# EAGLE schematic MJ828 - rev.3 - TCAN334 - prod (EAGLE 9.6.2)
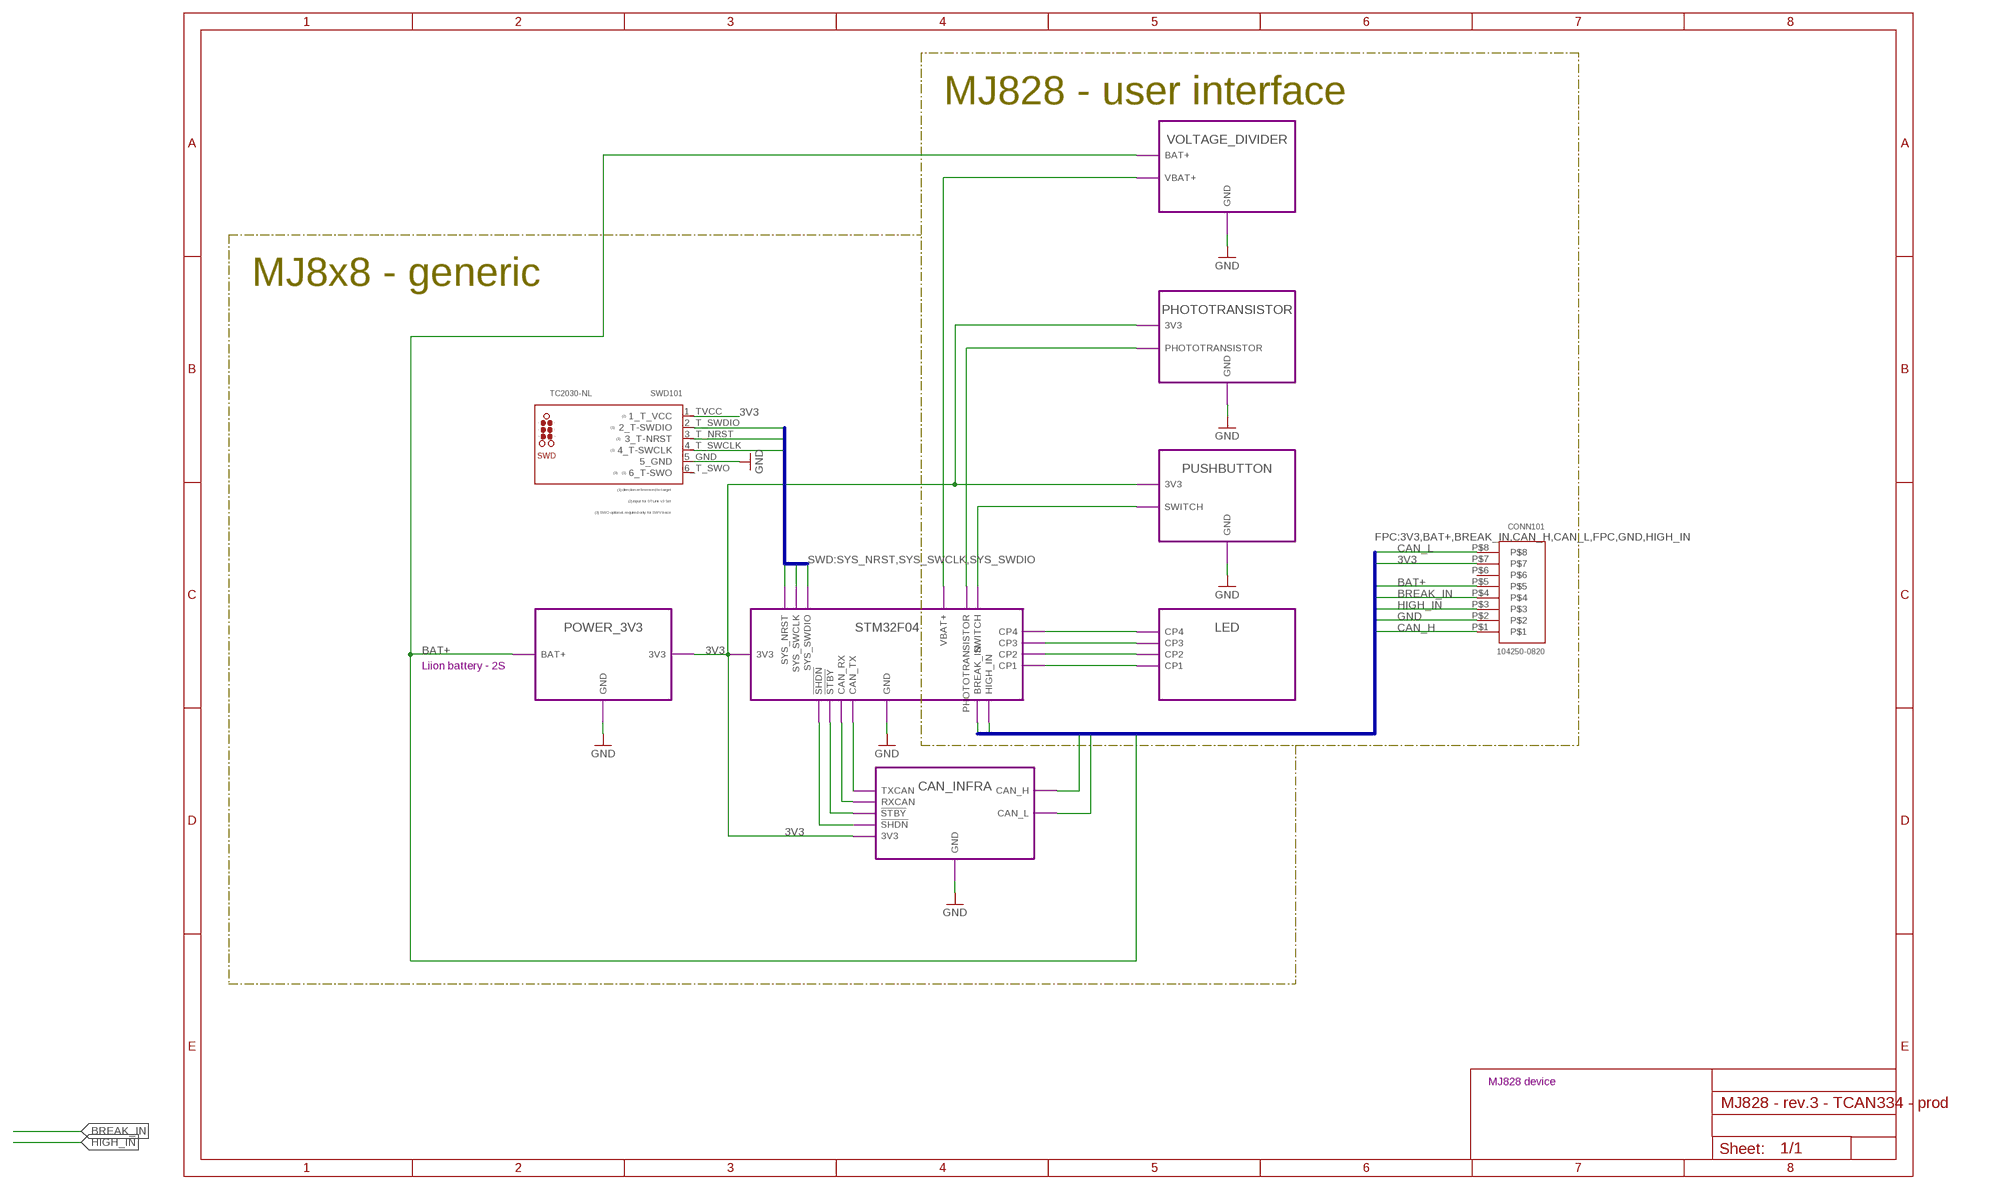
[diagram p0: schematic, sheet 1]

## Parts
CONN101  104250-0820  [SMD]
SWD101  TC2030-NL  TC2030  [TC2030-NL]

## Module instances
POWER_3V3 = POWER_3V3 (part numbers offset by 200)
STM32F04 = STM32 (part numbers offset by 400)
CAN_INFRA = CAN_INFRA (part numbers offset by 500)
PUSHBUTTON = PUSHBUTTON (part numbers offset by 700)
PHOTOTRANSISTOR = PHOTOTRANSISTOR (part numbers offset by 600)
LED = LED (part numbers offset by 800)
VOLTAGE_DIVIDER = VOLTAGE_DIVIDER (part numbers offset by 900)

## Nets
3V3 [3V3]: CONN101.P$7 SWD101.1_TVCC(1_T_VCC) ; port POWER_3V3.3V3 STM32F04.3V3 PUSHBUTTON.3V3 PHOTOTRANSISTOR.3V3 CAN_INFRA.3V3
!SHDN!: port STM32F04.!SHDN! CAN_INFRA.!SHDN!
!STBY! [signal]: port CAN_INFRA.!STBY! STM32F04.!STBY!
BAT+ [BAT+]: CONN101.P$5 ; port POWER_3V3.BAT+ VOLTAGE_DIVIDER.BAT+
BREAK_IN [signal]: CONN101.P$4 ; port STM32F04.BREAK_IN
CAN_H [signal]: CONN101.P$1 ; port CAN_INFRA.CAN_H
CAN_L [signal]: CONN101.P$8 ; port CAN_INFRA.CAN_L
CAN_RX [signal]: port CAN_INFRA.RXCAN STM32F04.CAN_RX
CAN_TX [signal]: port CAN_INFRA.TXCAN STM32F04.CAN_TX
CP1 [signal]: port STM32F04.CP1 LED.CP1
CP2 [signal]: port STM32F04.CP2 LED.CP2
CP3 [signal]: port STM32F04.CP3 LED.CP3
CP4 [signal]: port STM32F04.CP4 LED.CP4
GND: CONN101.P$2 SWD101.5_GND ; port STM32F04.GND POWER_3V3.GND CAN_INFRA.GND PUSHBUTTON.GND PHOTOTRANSISTOR.GND VOLTAGE_DIVIDER.GND
HIGH_IN [signal]: CONN101.P$3 ; port STM32F04.HIGH_IN
PHOTOTRANSISTOR: port PHOTOTRANSISTOR.PHOTOTRANSISTOR STM32F04.PHOTOTRANSISTOR
SWITCH: port STM32F04.SWITCH PUSHBUTTON.SWITCH
SYS_NRST [signal]: SWD101.3_T_NRST(3_T-NRST) ; port STM32F04.SYS_NRST
SYS_SWCLK [signal]: SWD101.4_T_SWCLK(4_T-SWCLK) ; port STM32F04.SYS_SWCLK
SYS_SWDIO [signal]: SWD101.2_T_SWDIO(2_T-SWDIO) ; port STM32F04.SYS_SWDIO
VBAT+: port STM32F04.VBAT+ VOLTAGE_DIVIDER.VBAT+
Unconnected: CONN101.P$6 SWD101.6_T_SWO(6_T-SWO)

## Buses
SWD:SYS_NRST,SYS_SWCLK,SYS_SWDIO
FPC:3V3,BAT+,BREAK_IN,CAN_H,CAN_L,FPC,GND,HIGH_IN

## Notes on the sheet
- MJ828 - user interface
- MJ8x8 - generic
- Liion battery - 2S
- MJ828 device

## Library data of the parts
CONN101 = 1042500820 - Board to Board Connector, 8p - Header:104250-0820
SWD101 = tag-connect:TC2030: TC2030 pad no. Function STLink v3 CN1 pin no. Function 1 Reserved (1) 2 Reserved (1) 1 T_Vcc 3 T_Vcc (2) 2 T_SWDIO 4 T_JTMS/T_SWDIO 5 GND 4 T_SWCLK 6 T_JCLK / T_SWCLK 5 GND 7 GND 6 8 T_JTDO / T_SWO (3) 9 T_JRCLK (4) / NC (5) 10 T_JTDI / NC (5) 11 GNDDetect (6) 3 T_NRST 12 T_NRST 13 T_VCP_RX (7) 14 T_VCP_TX (2) (1) Do not connect to the target (2) Input for STLINK-V3SET (3) SWO is optional, required only for Serial Wire Viewer (SWV) trace (4) Optional loopback of T_JCLK on the target side, required if loopback is removed on the STLINK-V3SET side (5) NC means not required for the SWD connection (6) Tied to GND by STLINK-V3SET firmware; may be used by the target for detection of the tool (7) Output for STLINK-V3SET

## Module POWER_3V3
Ports: GND(pwr) BAT+(pwr) 3V3(pwr)
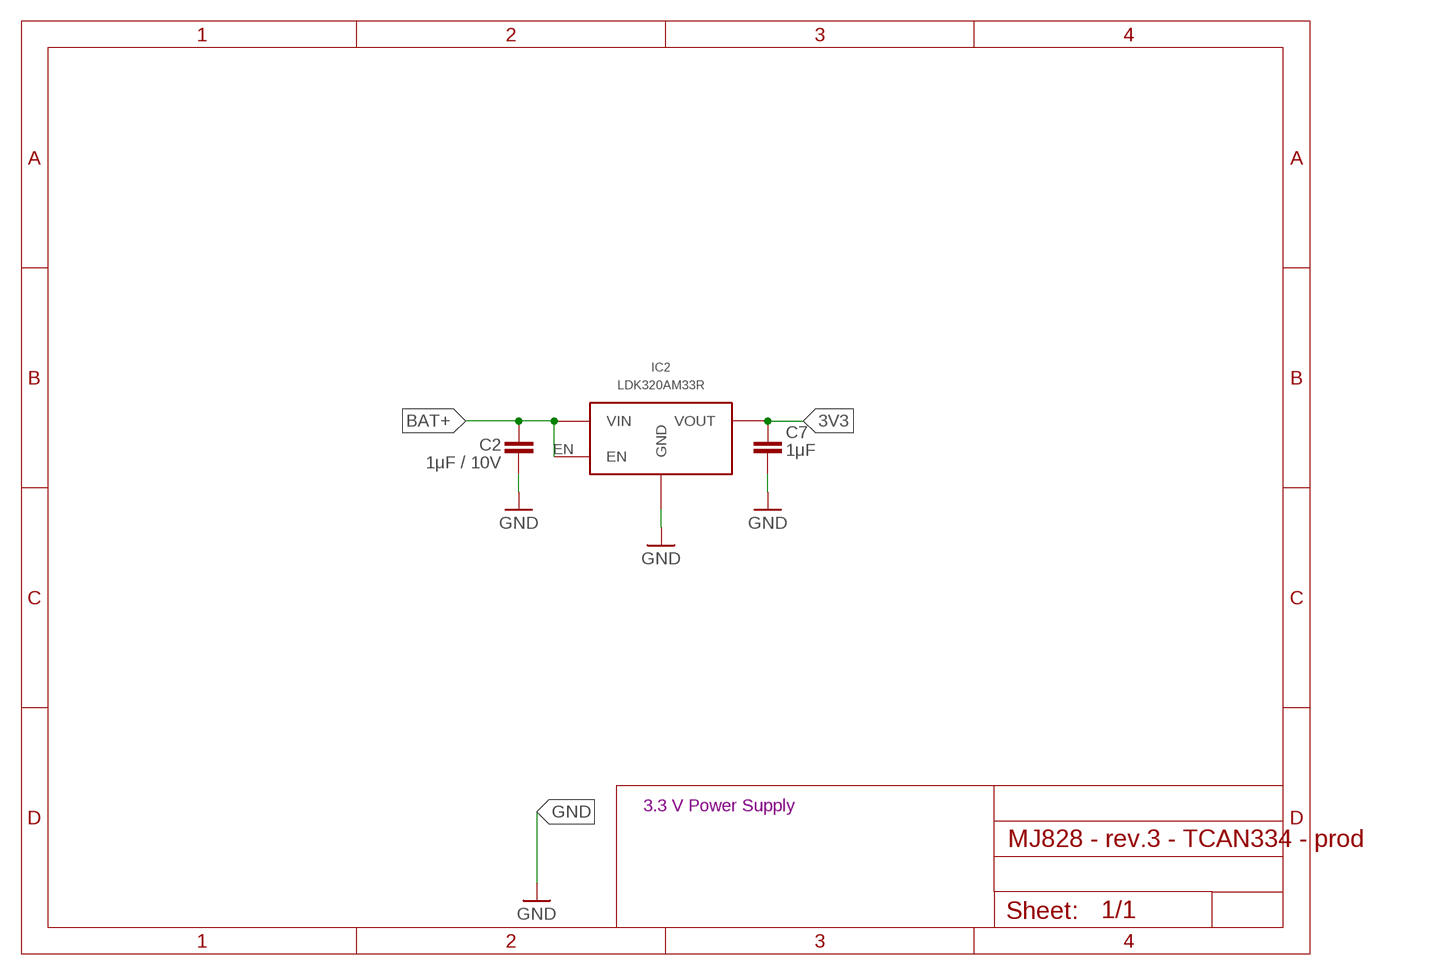
[diagram p1: schematic, module POWER_3V3, sheet 1]

### Parts
C2  1μF / 10V  C-EUC0402  [C0402]
C7  1μF  C-EUC0402  [C0402]
IC2  LDK320AM33R  LDK320SOT-23-5L  [SOT-23-5L]

### Nets
3V3 [3V3]: C7.2 IC2.OUT(VOUT)
BAT+ [BAT+]: C2.1 IC2.EN IC2.IN(VIN)
GND: C2.2 C7.1 IC2.GND

### Notes on the sheet
- 3.3 V Power Supply

### Library data of the parts
C2 C7 = rcl:C-EU: CAPACITOR, European symbol; SPICEPREFIX: C
IC2 = LDK320 5V LDO:LDK320

## Module STM32
Ports: GND(pwr) 3V3(pwr) SYS_NRST(in) SYS_SWCLK(io) SYS_SWDIO(io) CAN_RX(in) CAN_TX(out) !STBY!(out) SWITCH(in) PHOTOTRANSISTOR(in) CP4(pwr) CP3(pwr) CP2(pwr) CP1(pwr) BREAK_IN(in) HIGH_IN(in) VBAT+(in) !SHDN!(out)
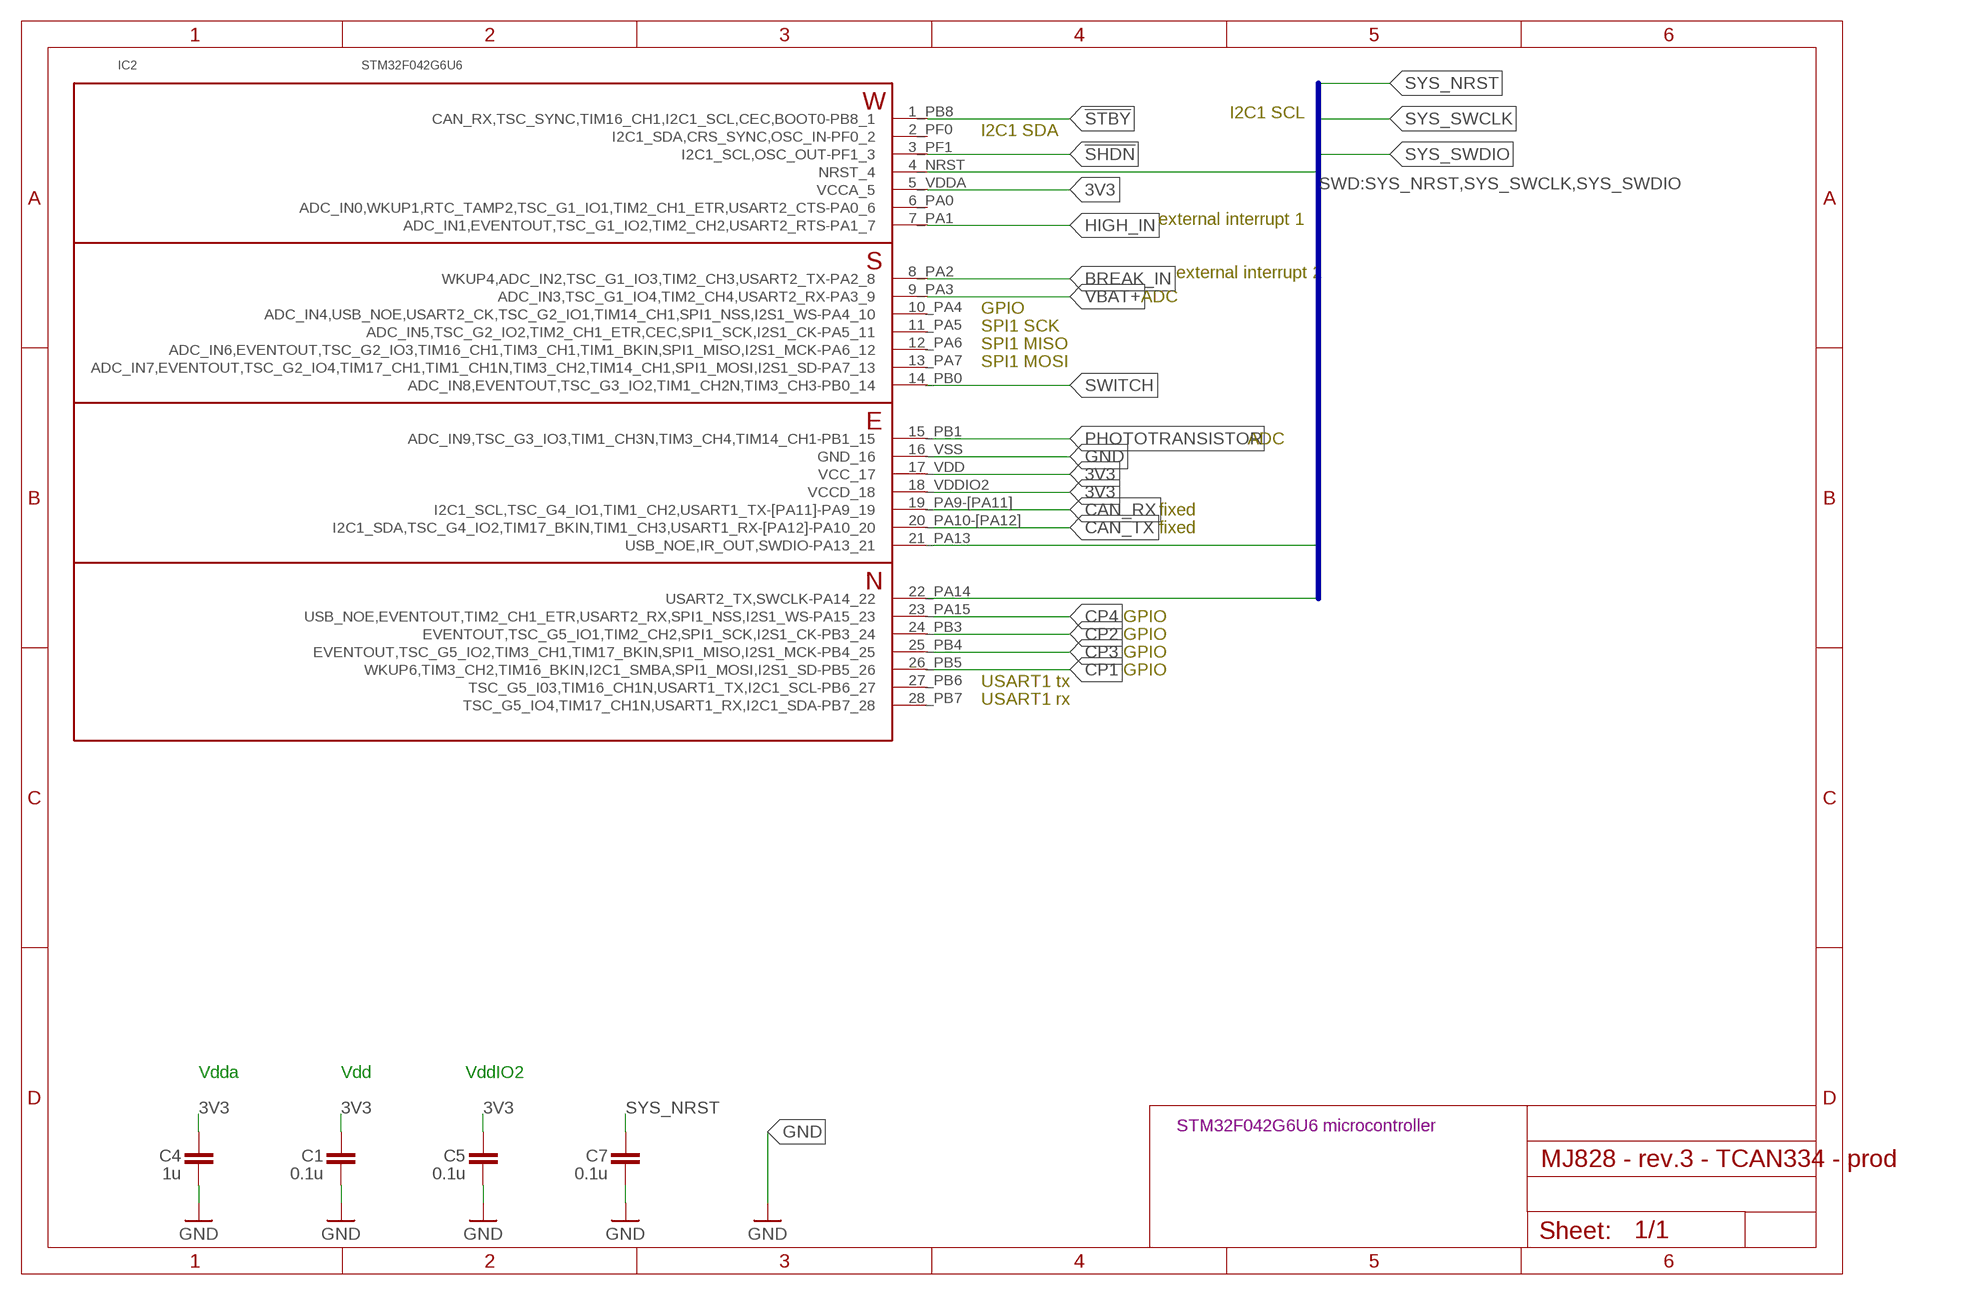
[diagram p2: schematic, module STM32, sheet 1]

### Parts
C1  0.1u  C-EUC0402  [C0402]
C4  1u  C-EUC0402  [C0402]
C5  0.1u  C-EUC0402  [C0402]
C7  0.1u  C-EUC0402  [C0402]
IC2  STM32F042G6U6  STM32F042G6  [UFQFPN-28]

### Nets
3V3 [3V3]: C1.2 C4.2 C5.2 IC2.5_VDDA(VCCA_5) IC2.17_VDD(VCC_17) IC2.18_VDDIO2(VCCD_18)
!SHDN!: IC2.3_PF1(I2C1_SCL,OSC_OUT-PF1_3)
!STBY!: IC2.1_PB8(CAN_RX,TSC_SYNC,TIM16_CH1,I2C1_SCL,CEC,BOOT0-PB8_1)
BREAK_IN [signal]: IC2.8_PA2(WKUP4,ADC_IN2,TSC_G1_IO3,TIM2_CH3,USART2_TX-PA2_8)
CAN_RX: IC2.19_PA9-[PA11](I2C1_SCL,TSC_G4_IO1,TIM1_CH2,USART1_TX-[PA11]-PA9_19)
CAN_TX: IC2.20_PA10-[PA12](I2C1_SDA,TSC_G4_IO2,TIM17_BKIN,TIM1_CH3,USART1_RX-[PA12]-PA10_20)
CP1 [signal]: IC2.26_PB5(WKUP6,TIM3_CH2,TIM16_BKIN,I2C1_SMBA,SPI1_MOSI,I2S1_SD-PB5_26)
CP2 [signal]: IC2.24_PB3(EVENTOUT,TSC_G5_IO1,TIM2_CH2,SPI1_SCK,I2S1_CK-PB3_24)
CP3 [signal]: IC2.25_PB4(EVENTOUT,TSC_G5_IO2,TIM3_CH1,TIM17_BKIN,SPI1_MISO,I2S1_MCK-PB4_25)
CP4 [signal]: IC2.23_PA15(USB_NOE,EVENTOUT,TIM2_CH1_ETR,USART2_RX,SPI1_NSS,I2S1_WS-PA15_23)
GND: C1.1 C4.1 C5.1 C7.1 IC2.16_VSS(GND_16)
HIGH_IN [signal]: IC2.7_PA1(ADC_IN1,EVENTOUT,TSC_G1_IO2,TIM2_CH2,USART2_RTS-PA1_7)
PHOTOTRANSISTOR: IC2.15_PB1(ADC_IN9,TSC_G3_IO3,TIM1_CH3N,TIM3_CH4,TIM14_CH1-PB1_15)
SWITCH: IC2.14_PB0(ADC_IN8,EVENTOUT,TSC_G3_IO2,TIM1_CH2N,TIM3_CH3-PB0_14)
SYS_NRST: C7.2 IC2.4_NRST(NRST_4)
SYS_SWCLK: IC2.22_PA14(USART2_TX,SWCLK-PA14_22)
SYS_SWDIO: IC2.21_PA13(USB_NOE,IR_OUT,SWDIO-PA13_21)
VBAT+: IC2.9_PA3(ADC_IN3,TSC_G1_IO4,TIM2_CH4,USART2_RX-PA3_9)
Unconnected: IC2.2_PF0(I2C1_SDA,CRS_SYNC,OSC_IN-PF0_2) IC2.6_PA0(ADC_IN0,WKUP1,RTC_TAMP2,TSC_G1_IO1,TIM2_CH1_ETR,USART2_CTS-PA0_6) IC2.10_PA4(ADC_IN4,USB_NOE,USART2_CK,TSC_G2_IO1,TIM14_CH1,SPI1_NSS,I2S1_WS-PA4_10) IC2.11_PA5(ADC_IN5,TSC_G2_IO2,TIM2_CH1_ETR,CEC,SPI1_SCK,I2S1_CK-PA5_11) IC2.12_PA6(ADC_IN6,EVENTOUT,TSC_G2_IO3,TIM16_CH1,TIM3_CH1,TIM1_BKIN,SPI1_MISO,I2S1_MCK-PA6_12) IC2.13_PA7(ADC_IN7,EVENTOUT,TSC_G2_IO4,TIM17_CH1,TIM1_CH1N,TIM3_CH2,TIM14_CH1,SPI1_MOSI,I2S1_SD-PA7_13) IC2.27_PB6(TSC_G5_I03,TIM16_CH1N,USART1_TX,I2C1_SCL-PB6_27) IC2.28_PB7(TSC_G5_IO4,TIM17_CH1N,USART1_RX,I2C1_SDA-PB7_28)

### Buses
SWD:SYS_NRST,SYS_SWCLK,SYS_SWDIO

### Notes on the sheet
- I2C1 SCL
- I2C1 SDA
- external interrupt 1
- external interrupt 2
- ADC
- GPIO
- SPI1 SCK
- SPI1 MISO
- SPI1 MOSI
- ADC
- fixed
- fixed
- GPIO
- GPIO
- GPIO
- GPIO
- USART1 tx
- USART1 rx
- Vdda | Vdd | VddIO2
- STM32F042G6U6 microcontroller

### Library data of the parts
C1 C4 C5 C7 = rcl:C-EU: CAPACITOR, European symbol; SPICEPREFIX: C
IC2 = STM32F042G6:STM32F042G6

## Module CAN_INFRA
Ports: GND(pwr) 3V3(pwr) CAN_H(io) CAN_L(io) TXCAN(in) RXCAN(out) !STBY!(in) !SHDN!(in)
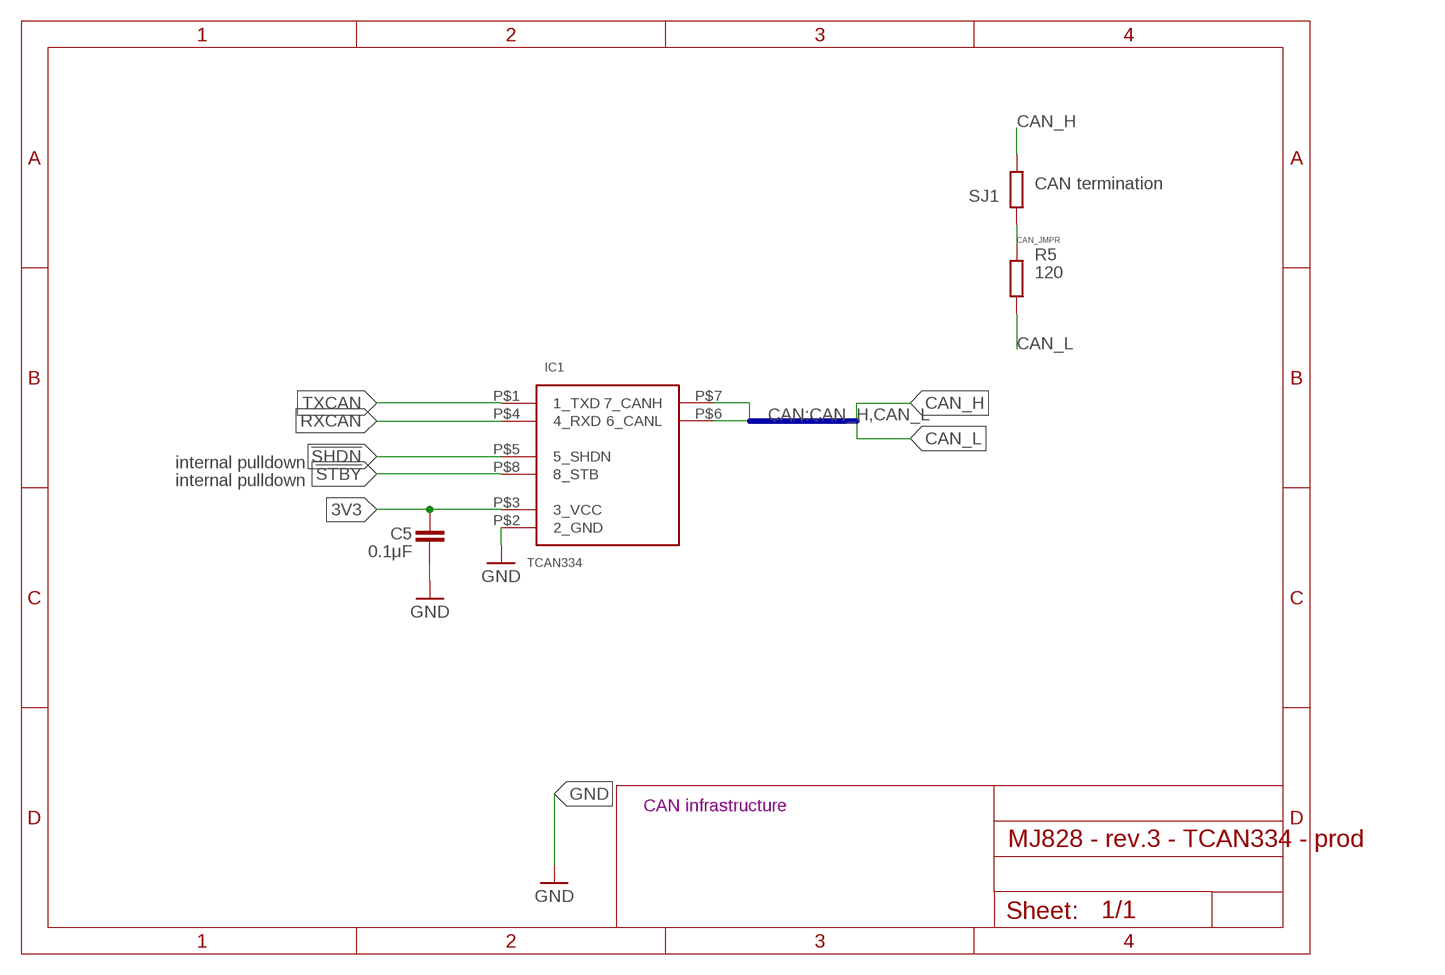
[diagram p3: schematic, module CAN_INFRA, sheet 1]

### Parts
C5  0.1μF  C-EUC0402  [C0402]
IC1  TCAN334  CAN33X  [SOT23-8]
R5  120  R-EU_R0805  [R0805]
SJ1  CAN termination  R-EU_R0402  [R0402]

### Nets
3V3 [3V3]: C5.1 IC1.P$3(3_VCC)
!SHDN!: IC1.P$5(5_SHDN)
!STBY! [signal]: IC1.P$8(8_STB)
CAN_H: IC1.P$7(7_CANH) SJ1.2
CAN_JMPR [signal]: R5.2 SJ1.1
CAN_L: IC1.P$6(6_CANL) R5.1
GND: C5.2 IC1.P$2(2_GND)
RXCAN [signal]: IC1.P$4(4_RXD)
TXCAN [signal]: IC1.P$1(1_TXD)

### Buses
CAN:CAN_H,CAN_L

### Notes on the sheet
- internal pulldown
- internal pulldown
- CAN infrastructure

### Library data of the parts
C5 = rcl:C-EU: CAPACITOR, European symbol; SPICEPREFIX: C
IC1 = TCAN33x - 3.3V CAN Transciever:CAN33X
R5 SJ1 = rcl:R-EU_: RESISTOR, European symbol; SPICEPREFIX: R

## Module PUSHBUTTON
Ports: GND(pwr) 3V3(pwr) SWITCH(out)
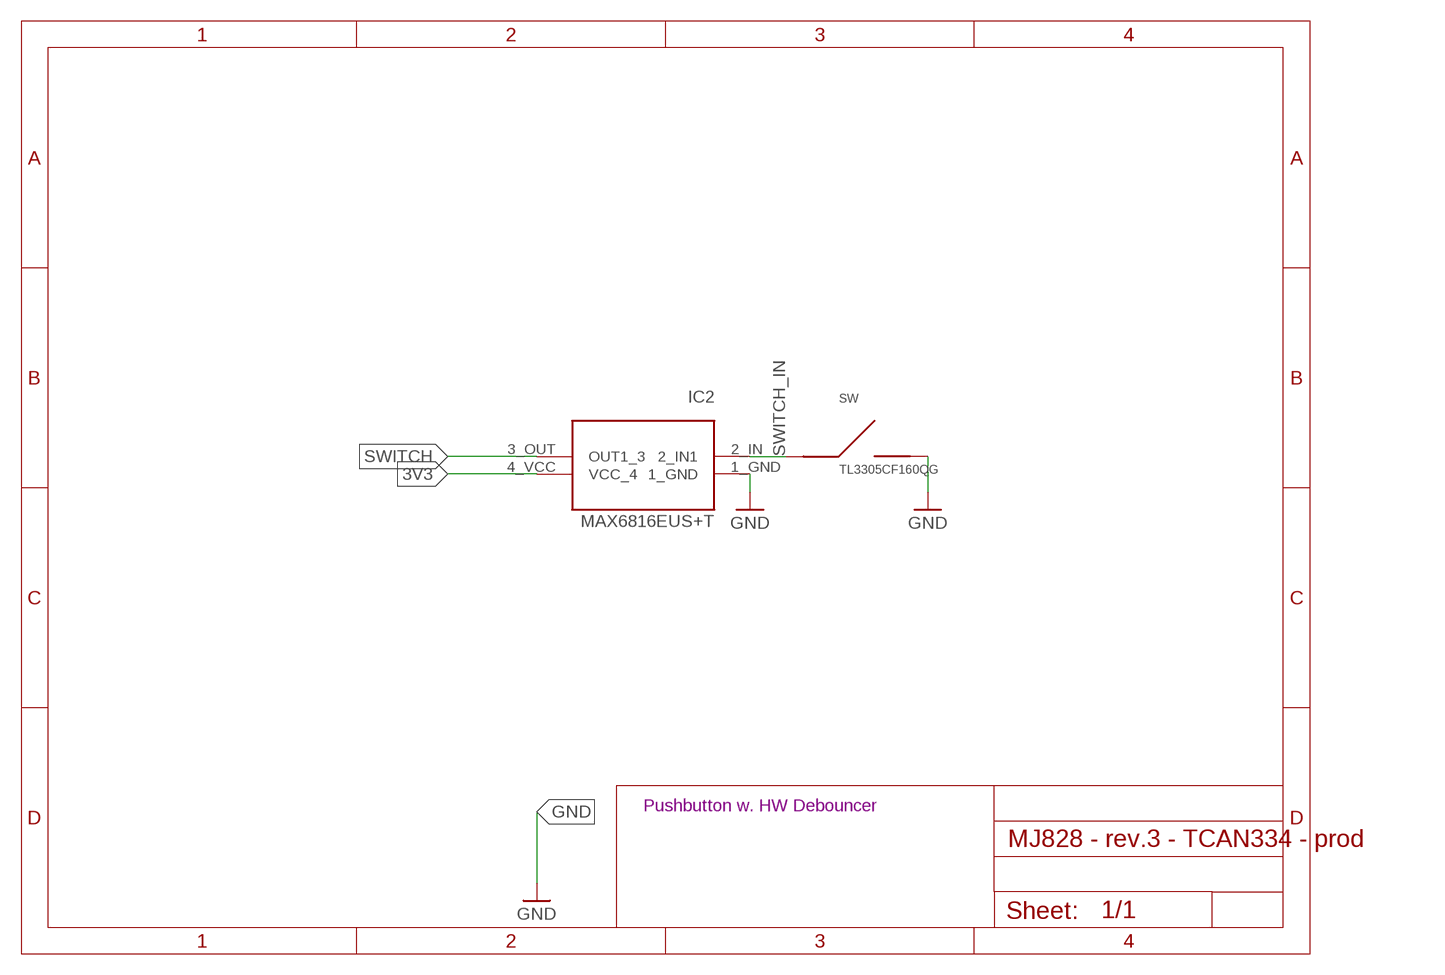
[diagram p4: schematic, module PUSHBUTTON, sheet 1]

### Parts
IC2  MAX6816EUS+T  MAX6816  [4SOT143]
SW  TL3305CF160QG  TL3305-844809  [SMD]

### Nets
3V3: IC2.4_VCC(VCC_4)
GND: IC2.1_GND SW.3 SW.4
SWITCH: IC2.3_OUT(OUT1_3)
SWITCH_IN: IC2.2_IN(2_IN1) SW.1 SW.2

### Notes on the sheet
- Pushbutton w. HW Debouncer

### Library data of the parts
IC2 = MAX6818 CMOS Switch debouncer:MAX6816
SW = TL3305-844809 SPST-NO Tact Switch:TL3305-844809

## Module PHOTOTRANSISTOR
Ports: GND(pwr) 3V3(pwr) PHOTOTRANSISTOR(out)
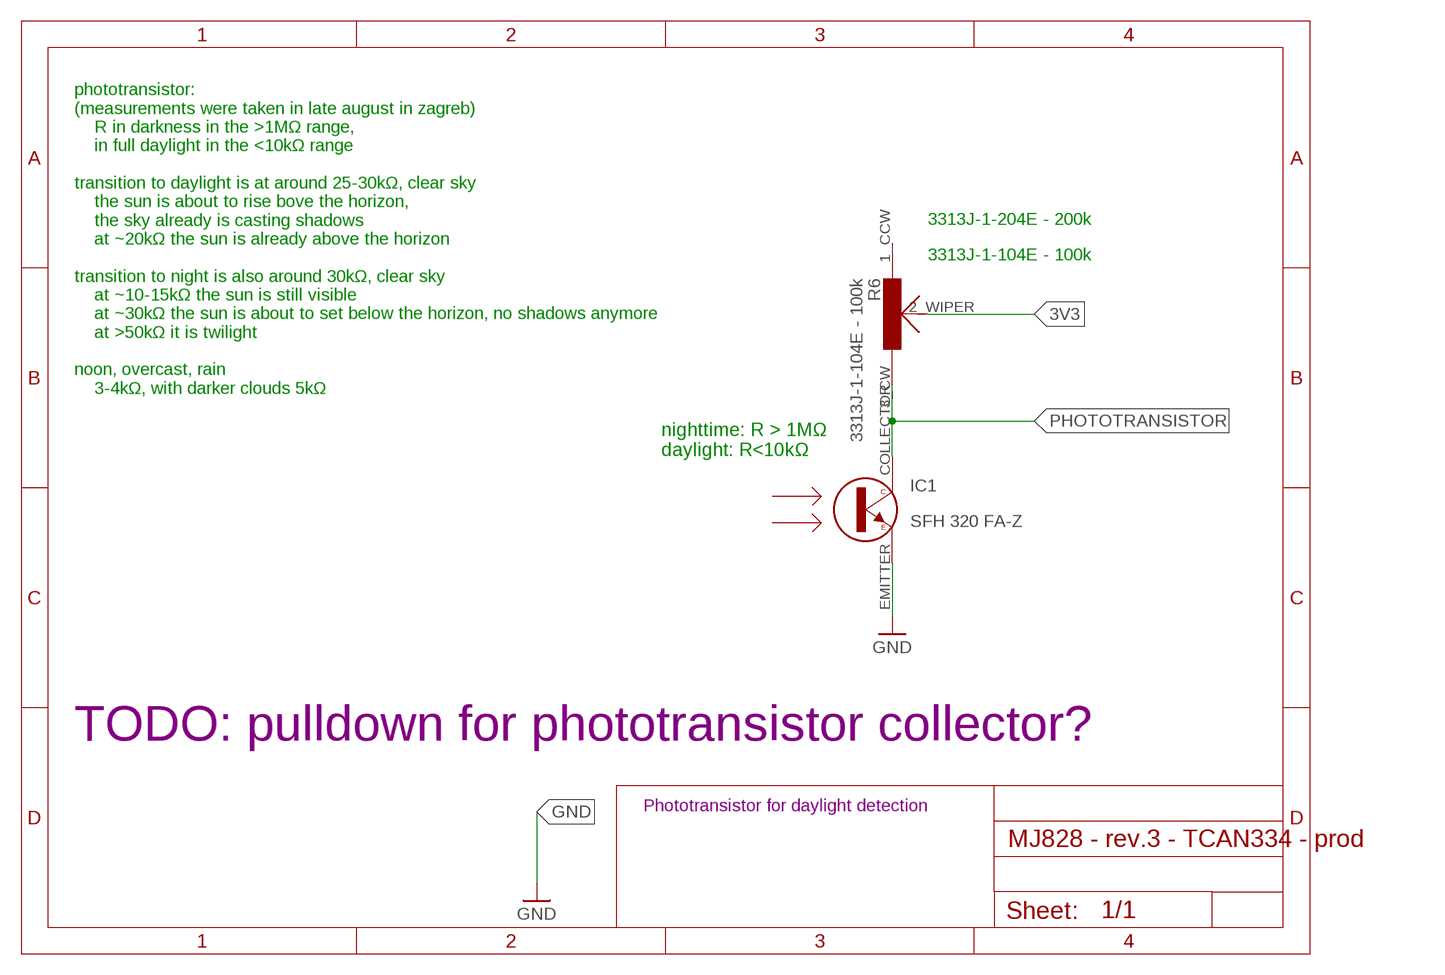
[diagram p5: schematic, module PHOTOTRANSISTOR, sheet 1]

### Parts
IC1  SFH 320 FA-Z  SFH320FA  [P-LCC-2]
R6  3313J-1-104E - 100k  3313  [3313]

### Nets
3V3: R6.2_WIPER
GND: IC1.EMITTER
PHOTOTRANSISTOR: IC1.COLLECTOR R6.3_CW
Unconnected: R6.1_CCW

### Notes on the sheet
- phototransistor: 
  (measurements were taken in late august in zagreb)
      R in darkness in the >1MΩ range, 
      in full daylight in the <10kΩ range 
  
  transition to daylight is at around 25-30kΩ, clear sky
      the sun is about to rise bove the horizon,
      the sky already is casting shadows
      at ~20kΩ the sun is already above the horizon
  
  transition to night is also around 30kΩ, clear sky
      at ~10-15kΩ the sun is still visible
      at ~30kΩ the sun is about to set below the horizon, no shadows anymore
      at >50kΩ it is twilight
  
  noon, overcast, rain
      3-4kΩ, with darker clouds 5kΩ
- 3313J-1-204E - 200k
- 3313J-1-104E - 100k
- nighttime: R > 1MΩ
  daylight: R<10kΩ
- TODO: pulldown for phototransistor collector?
- Phototransistor for daylight detection

### Library data of the parts
IC1 = SFH 320 FA - IR Phototransistor:SFH320FA
R6 = 3313 - Trim Poti:3313

## Module LED
Ports: CP1(pwr) CP2(pwr) CP3(pwr) CP4(pwr)
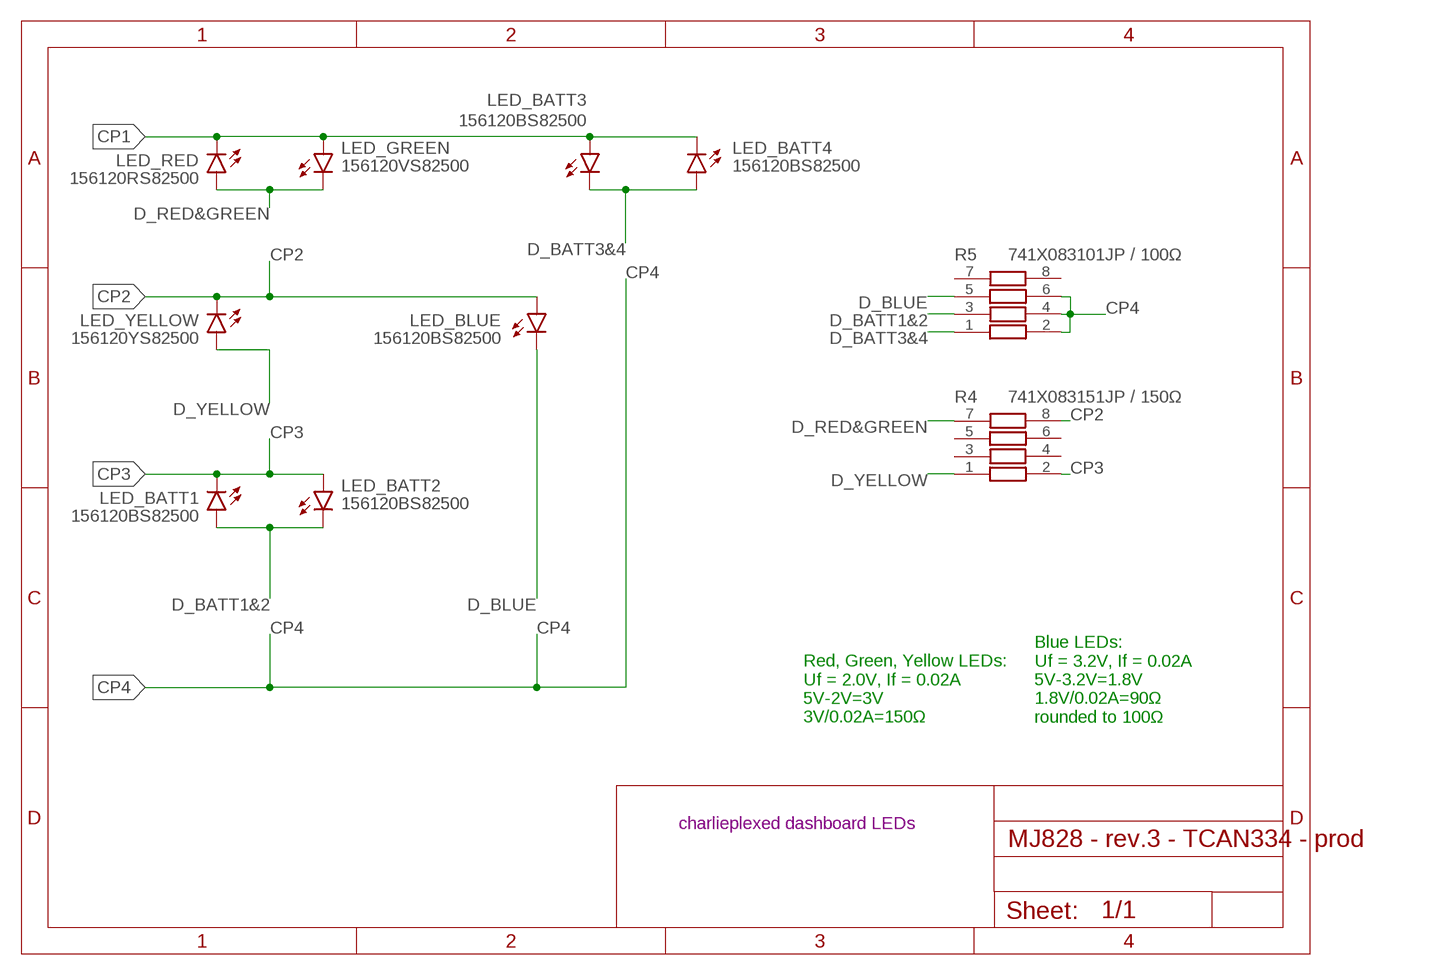
[diagram p6: schematic, module LED, sheet 1]

### Parts
LED_BATT1  156120BS82500  LEDSML1206  [SML1206]
LED_BATT2  156120BS82500  LEDSML1206  [SML1206]
LED_BATT3  156120BS82500  LEDSML1206  [SML1206]
LED_BATT4  156120BS82500  LEDSML1206  [SML1206]
LED_BLUE  156120BS82500  LEDSML1206  [SML1206]
LED_GREEN  156120VS82500  LEDSML1206  [SML1206]
LED_RED  156120RS82500  LEDSML1206  [SML1206]
LED_YELLOW  156120YS82500  LEDSML1206  [SML1206]
R4  741X083151JP / 150Ω  741X083331JP  [0402]
R5  741X083101JP / 100Ω  741X083331JP  [0402]

### Nets
CP1 [signal]: LED_BATT3.A LED_BATT4.C LED_GREEN.A LED_RED.C
CP2 [signal]: LED_BLUE.A LED_YELLOW.C R4.8
CP3 [signal]: LED_BATT1.C LED_BATT2.A R4.2
CP4 [signal]: R5.2 R5.4 R5.6
D_BATT1&2 [signal]: LED_BATT1.A LED_BATT2.C R5.3
D_BATT3&4 [signal]: LED_BATT3.C LED_BATT4.A R5.1
D_BLUE [signal]: LED_BLUE.C R5.5
D_RED&GREEN [signal]: LED_GREEN.C LED_RED.A R4.7
D_YELLOW [signal]: LED_YELLOW.A R4.1
Unconnected: R4.3 R4.4 R4.5 R4.6 R5.7 R5.8

### Notes on the sheet
- Red, Green, Yellow LEDs:
  Uf = 2.0V, If = 0.02A
  5V-2V=3V
  3V/0.02A=150Ω
- Blue LEDs:
  Uf = 3.2V, If = 0.02A
  5V-3.2V=1.8V
  1.8V/0.02A=90Ω
  rounded to 100Ω
- charlieplexed dashboard LEDs

### Library data of the parts
LED_BATT1-LED_BATT4 LED_BLUE LED_GREEN LED_RED LED_YELLOW = led:LED: LED OSRAM: - CHIPLED LG R971, LG N971, LY N971, LG Q971, LY Q971, LO R971, LY R971 LH N974, LH R974 LS Q976, LO Q976, LY Q976 LO Q996 - Hyper CHIPLED LW Q18S LB Q993, LB Q99A, LB R99A - SideLED LS A670, LO A670, LY A670, LG A670, LP A670 LB A673, LV A673, LT A673, LW A673 LH A674 LY A675 LS A676, LA A676, LO A676, LY A676, LW A676 LS A679, LY A679, LG A679 - Hyper Micro SIDELED® LS Y876, LA Y876, LO Y876, LY Y876 LT Y87S - SmartLED LW L88C, LW L88S LB L89C, LB L89S, LG L890 LS L89K, LO L89K, LY L89K LS L896, LA L896, LO L896, LY L896 - TOPLED LS T670, LO T670, LY T670, LG T670, LP T670 LSG T670, LSP T670, LSY T670, LOP T670, LYG T670 LG T671, LOG T671, LSG T671 LB T673, LV T673, LT T673, LW T673 LH T674 LS T676, LA T676, LO T676, LY T676, LB T676, LH T676, LSB T676, LW T676 LB T67C, LV T67C, LT T67C, LS T67K, LO T67K, LY T67K, LW E67C LS E67B, LA E67B, LO E67B, LY E67B, LB E67C, LV E67C, LT E67C LW T67C LS T679, LY T679, LG T679 LS T770, LO T770, LY T770, LG T770, LP T770 LB T773, LV T773, LT T773, LW T773 LH T774 LS E675, LA E675, LY E675, LS T675 LS T776, LA T776, LO T776, LY T776, LB T776 LHGB T686 LT T68C, LB T68C - Hyper Mini TOPLED® LB M676 - Mini TOPLED Santana® LG M470 LS M47K, LO M47K, LY M47K Source: http://www.osram.convergy.de LUXEON: - LUMILED® LXK2-PW12-R00, LXK2-PW12-S00, LXK2-PW14-U00, LXK2-PW14-V00 LXK2-PM12-R00, LXK2-PM12-S00, LXK2-PM14-U00 LXK2-PE12-Q00, LXK2-PE12-R00, LXK2-PE12-S00, LXK2-PE14-T00, LXK2-PE14-U00 LXK2-PB12-K00, LXK2-PB12-L00, LXK2-PB12-M00, LXK2-PB14-N00, LXK2-PB14-P00, LXK2-PB14-Q00 LXK2-PR12-L00, LXK2-PR12-M00, LXK2-PR14-Q00, LXK2-PR14-R00 LXK2-PD12-Q00, LXK2-PD12-R00, LXK2-PD12-S00 LXK2-PH12-R00, LXK2-PH12-S00 LXK2-PL12-P00, LXK2-PL12-Q00, LXK2-PL12-R00 Source: www.luxeon.com KINGBRIGHT: KA-3528ASYC Source: www.kingbright.com
R4 R5 = 741X083331JP Resistor Array:741X083331JP

## Module VOLTAGE_DIVIDER
Ports: GND(pwr) BAT+(pwr) VBAT+(out)
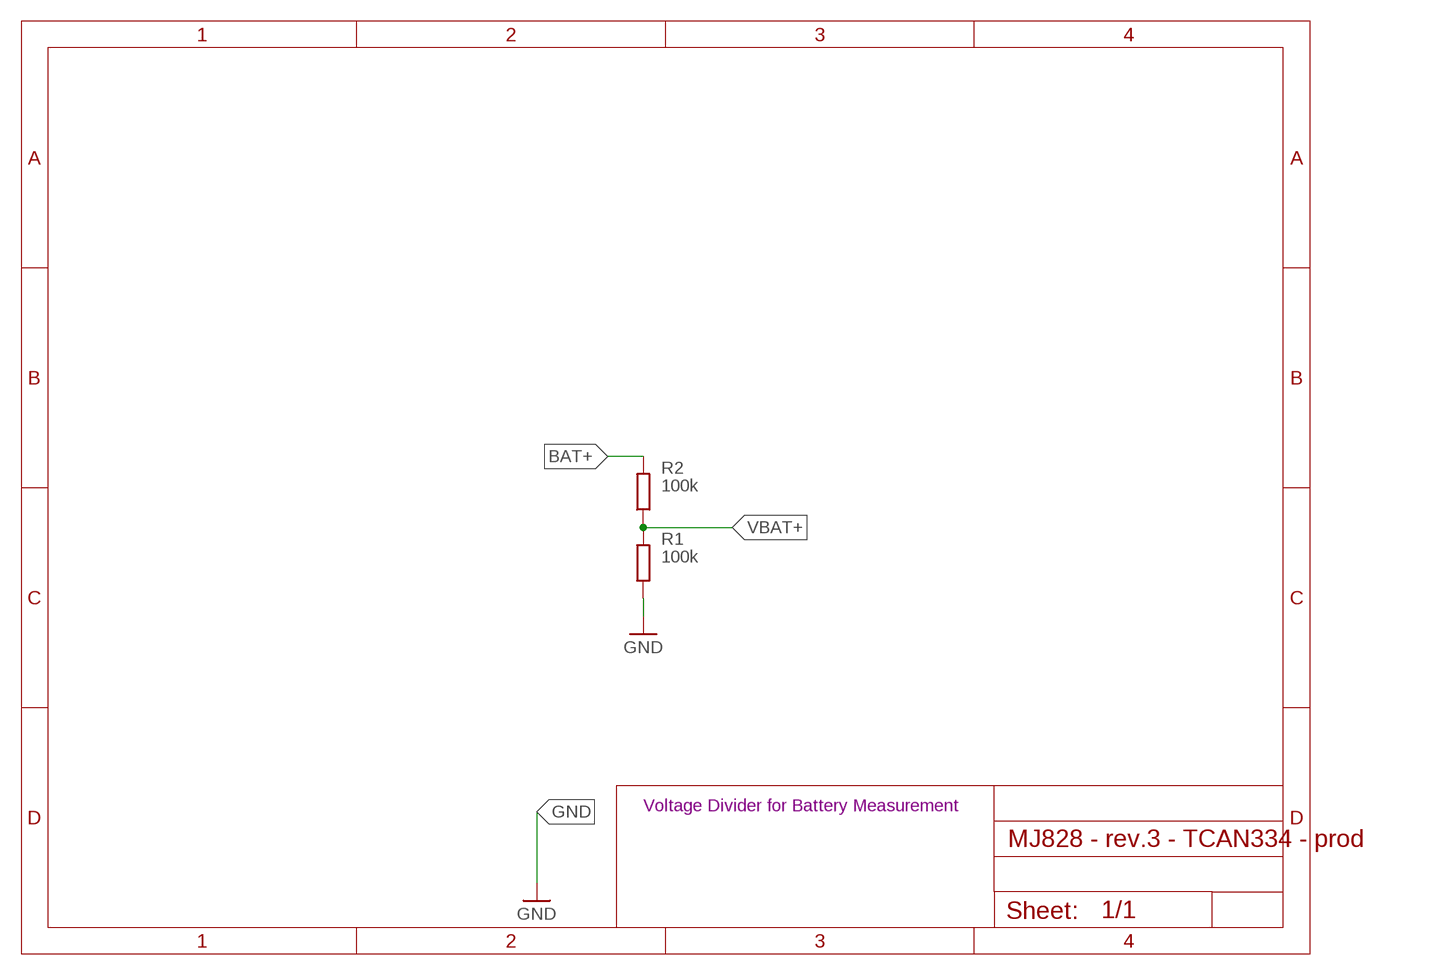
[diagram p7: schematic, module VOLTAGE_DIVIDER, sheet 1]

### Parts
R1  100k  R-EU_R0402  [R0402]
R2  100k  R-EU_R0402  [R0402]

### Nets
BAT+: R2.2
GND: R1.1
VBAT+: R1.2 R2.1

### Notes on the sheet
- Voltage Divider for Battery Measurement

### Library data of the parts
R1 R2 = rcl:R-EU_: RESISTOR, European symbol; SPICEPREFIX: R

## Net classes
0 GND: width 0.25 mm, drill 0.35 mm, clearance 0.19 mm
1 BAT+: width 0.5 mm, drill 0.35 mm, clearance 0.19 mm
3 signal: width 0.25 mm, drill 0.35 mm, clearance 0.19 mm
4 3V3: width 0.25 mm, drill 0.35 mm, clearance 0.25 mm